# EAGLE design lightmeter_proto2 (EAGLE 7.1.0)
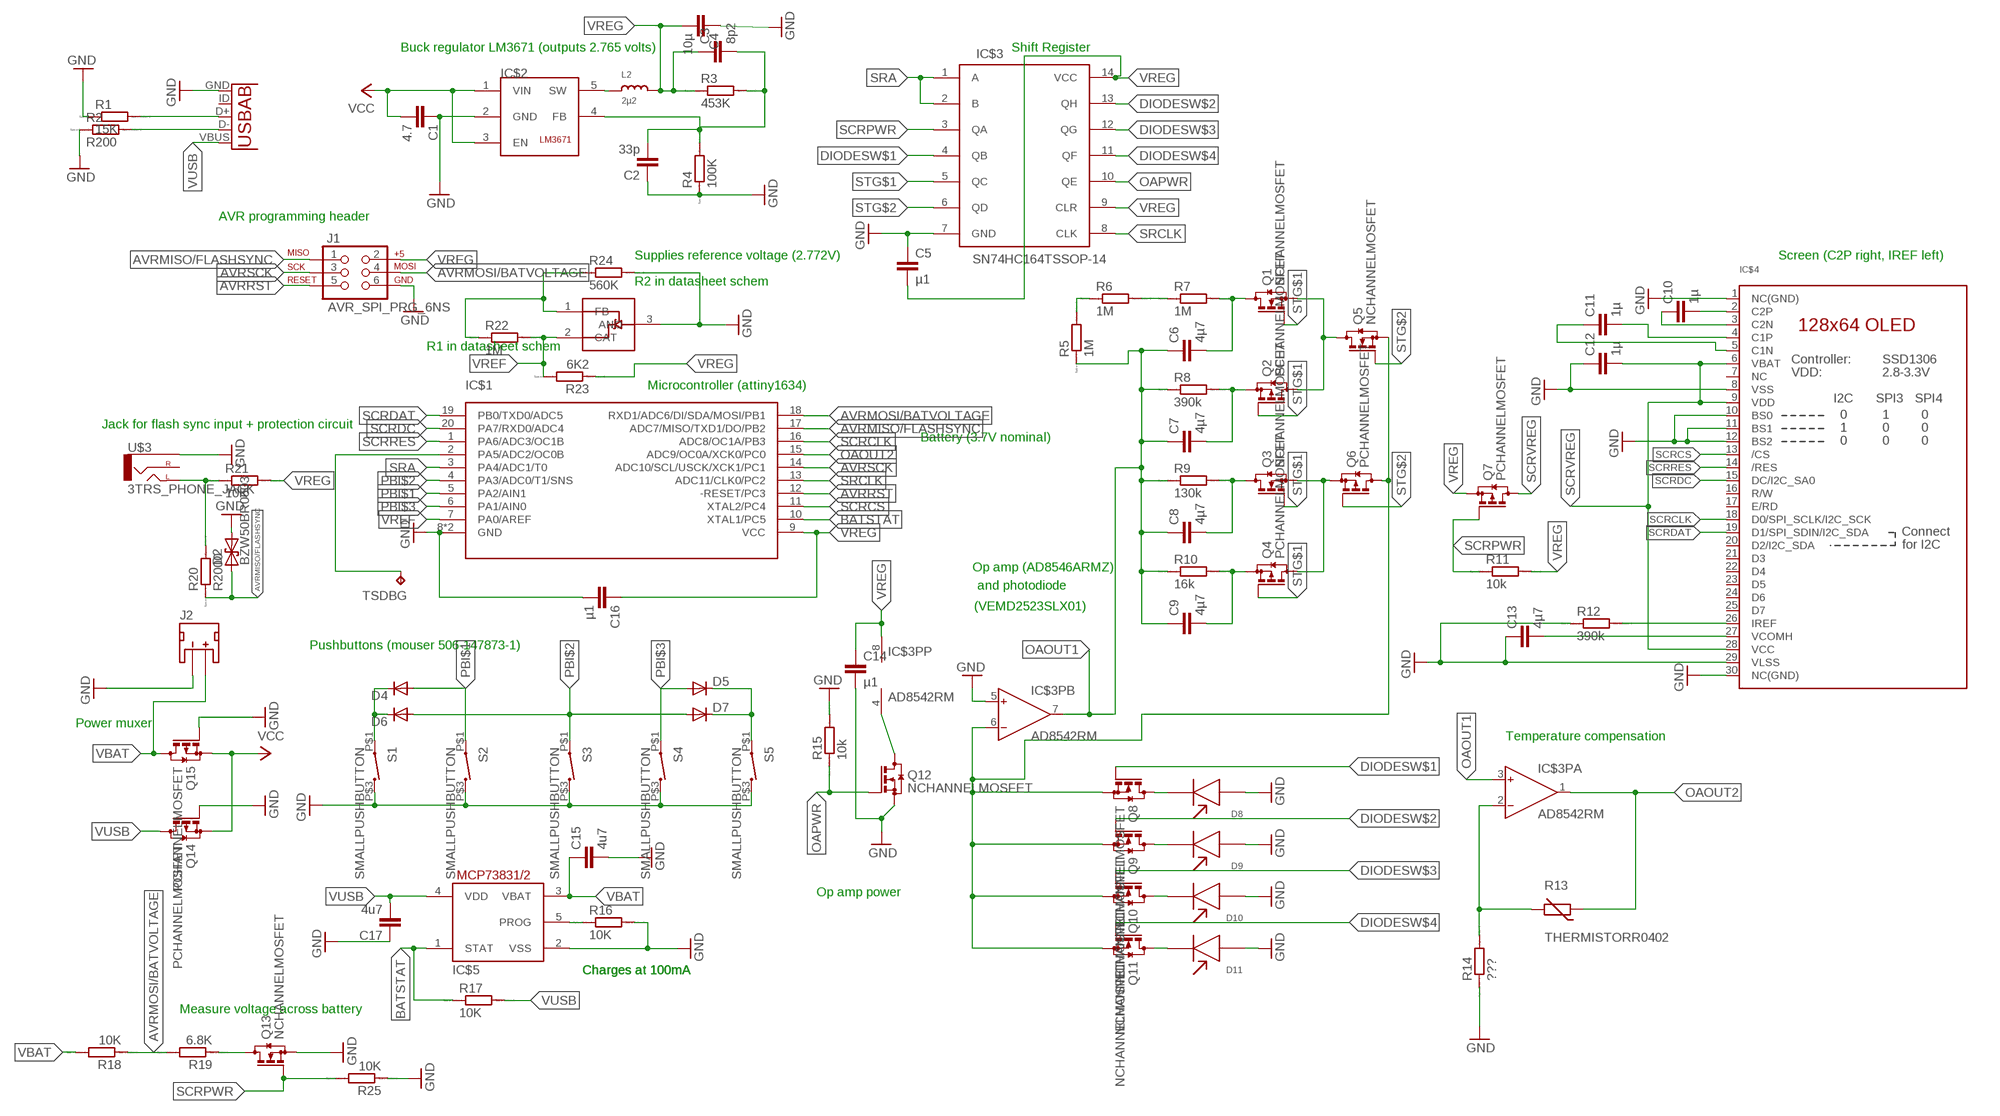
[diagram p0: schematic, sheet 1]

## Parts
C1  4.7  C-EUC0402  [C0402]
C2  33p  C-EUC0402  [C0402]
C3  8p2  C-EUC0402  [C0402]
C4  10µ  C-EUC0402  [C0402]
C5  µ1  C-EUC0402  [C0402]
C6  4µ7  C-EUC0402  [C0402]
C7  4µ7  C-EUC0402  [C0402]
C8  4µ7  C-EUC0402  [C0402]
C9  4µ7  C-EUC0402  [C0402]
C10  1µ  C-EUC0402  [C0402]
C11  1µ  C-EUC0402  [C0402]
C12  1µ  C-EUC0402  [C0402]
C13  4µ7  C-EUC0402  [C0402]
C14  µ1  C-EUC0402  [C0402]
C15  4u7  C-EUC0402  [C0402]
C16  µ1  C-EUC0402  [C0402]
C17  4u7  C-EUC0402  [C0402]
D2  BZW50BR0603  [R0603]
D4  DIODE-SOD323-W  [SOD323-W]
D5  DIODE-SOD323-W  [SOD323-W]
D6  DIODE-SOD323-W  [SOD323-W]
D7  DIODE-SOD323-W  [SOD323-W]
D8  VEMD2523SLX01  [VEMD2523SLX01]
D9  VEMD2523SLX01  [VEMD2523SLX01]
D10  VEMD2523SLX01  [VEMD2523SLX01]
D11  VEMD2523SLX01  [VEMD2523SLX01]
IC$1  ATTINY1634MLF20  [MLF20]
IC$2  LM3671  [SOT23-5]
IC$3  SN74HC164TSSOP-14  [TSSOP14]
IC$3P  AD8542RM  [MSOP08]
IC$4  DISP_OLED_UG-2864HSWEG010.96"  [UG-2864HSWEG01_0.96IN_WRAPAROUND]
IC$5  MCP73831/OT  [SOT23-5L]
IC$6  TL4051  [SOT23]
J1  AVR_SPI_PRG_6NS  [2X3-NS]
J2  JST_2MM_MALE  [JST-2-SMD]
L2  2µ2  INDUCTOR_0402  [_0402]
Q1  NCHANNELMOSFET  [SOT-416-3]
Q2  PCHANNELMOSFET  [SOT-416-3]
Q3  NCHANNELMOSFET  [SOT-416-3]
Q4  PCHANNELMOSFET  [SOT-416-3]
Q5  NCHANNELMOSFET  [SOT-416-3]
Q6  PCHANNELMOSFET  [SOT-416-3]
Q7  PCHANNELMOSFET  [SOT-416-3]
Q8  NCHANNELMOSFET  [SOT-416-3]
Q9  NCHANNELMOSFET  [SOT-416-3]
Q10  NCHANNELMOSFET  [SOT-416-3]
Q11  NCHANNELMOSFET  [SOT-416-3]
Q12  NCHANNELMOSFET  [SOT-416-3]
Q13  NCHANNELMOSFET  [SOT-416-3]
Q14  PCHANNELMOSFET  [SOT-416-3]
Q15  PCHANNELMOSFET  [SOT-416-3]
R1  15K  R-EU_R0402  [R0402]
R2  R200  R-EU_R0402  [R0402]
R3  453K  R-EU_R0402  [R0402]
R4  100K  R-EU_R0402  [R0402]
R5  1M  R-EU_R0402  [R0402]
R6  1M  R-EU_R0402  [R0402]
R7  1M  R-EU_R0402  [R0402]
R8  390k  R-EU_R0402  [R0402]
R9  130k  R-EU_R0402  [R0402]
R10  16k  R-EU_R0402  [R0402]
R11  10k  R-EU_R0402  [R0402]
R12  390k  R-EU_R0402  [R0402]
R13  THERMISTORR0402  [R0402]
R14  ???  R-EU_R0402  [R0402]
R15  10k  R-EU_R0402  [R0402]
R16  10K  R-EU_R0402  [R0402]
R17  10K  R-EU_R0402  [R0402]
R18  10K  R-EU_R0402  [R0402]
R19  6.8K  R-EU_R0402  [R0402]
R20  R2000  R-EU_R0402  [R0402]
R21  10K  R-EU_R0402  [R0402]
R22  1M  R-EU_R0402  [R0402]
R23  6K2  R-EU_R0402  [R0402]
R24  560K  R-EU_R0402  [R0402]
R25  10K  R-EU_R0402  [R0402]
S1  SMALLPUSHBUTTON  [BUTTON]
S2  SMALLPUSHBUTTON  [BUTTON]
S3  SMALLPUSHBUTTON  [BUTTON]
S4  SMALLPUSHBUTTON  [BUTTON]
S5  SMALLPUSHBUTTON  [BUTTON]
TSDBG  TPPAD1-13  [P1-13]
U2  USB-AB"  [USB_AB_MICRO_1:1_V2]
U$3  3TRS_PHONE_JACK  [3TRS-SMD]

## Nets
AVRMISO/FLASHSYNC: D2.1 IC$1.17(ADC7/MISO/TXD1/DO/PB2) J1.1 R20.1
AVRMOSI/BATVOLTAGE: IC$1.18(RXD1/ADC6/DI/SDA/MOSI/PB1) J1.4 R18.1 R19.2
AVRRST: IC$1.12(-RESET/PC3) J1.5
AVRSCK: IC$1.14(ADC10/SCL/USCK/XCK1/PC1) J1.3
BATSTAT: IC$1.10(XTAL1/PC5) IC$5.1(STAT) R17.1
DIODESW$1: IC$3.4(QB) Q8.P$1(G)
DIODESW$2: IC$3.13(QH) Q9.P$1(G)
DIODESW$3: IC$3.12(QG) Q10.P$1(G)
DIODESW$4: IC$3.11(QF) Q11.P$1(G)
GND: C1.1 C2.1 C4.1 C5.1 C12.1 C13.1 C14.2 C15.2 C16.2 C17.1 D2.2 D8.P$1 D9.P$1 D10.P$1 D11.P$1 IC$1.8(GND) IC$1.GND IC$2.2(GND) IC$3.7(GND) IC$3P.5(B:IN+) IC$4.1(NC(GND)) IC$4.8(VSS) IC$4.10(BS0) IC$4.11(BS1) IC$4.12(BS2) IC$4.29(VLSS) IC$4.30(NC(GND)) IC$5.2(VSS) IC$6.3(ANO) J1.6 J2.1(-) Q12.P$2(S) Q13.P$2(S) Q14.P$1(G) Q15.P$1(G) R1.1 R2.1 R4.1 R12.1 R14.1 R15.2 R16.2 R24.2 R25.1 S1.P$3 S2.P$3 S3.P$3 S4.P$3 S5.P$3 U2.GND U$3.P$1(SLEEVE)
N$1: D8.P$2 Q8.P$3(D)
N$2: D9.P$2 Q9.P$3(D)
N$3: C7.2 Q2.P$2(S) R8.2
N$4: C9.2 Q4.P$2(S) R10.2
N$5: IC$5.5(PROG) R16.1
N$6: IC$3P.4(P:V-) Q12.P$3(D)
N$7: D5.C D7.C S5.P$1
N$8: D4.C D6.C S1.P$1
N$9: D10.P$2 Q10.P$3(D)
N$10: IC$2.5(SW) L2.1
N$11: D11.P$2 Q11.P$3(D)
N$12: C13.2 IC$4.27(VCOMH)
N$13: R6.2 R7.1
N$14: C8.2 Q3.P$3(D) R9.2
N$15: C10.2 IC$4.2(C2P)
N$16: C10.1 IC$4.3(C2N)
N$17: Q13.P$3(D) R19.1
N$18: R5.2 R6.1
N$19: IC$4.26(IREF) R12.2
N$20: Q1.P$2(S) Q2.P$3(D) Q5.P$3(D)
N$21: C6.2 Q1.P$3(D) R7.2
N$22: Q3.P$2(S) Q4.P$3(D) Q6.P$2(S)
N$23: IC$1.2(PA5/ADC2/OC0B) TSDBG.TP
N$24: C11.1 IC$4.5(C1N)
N$25: IC$6.1(FB) R22.1 R24.1
N$26: IC$3P.6(B:IN-) Q5.P$2(S) Q6.P$3(D) Q8.P$2(S) Q9.P$2(S) Q10.P$2(S) Q11.P$2(S)
N$27: C11.2 IC$4.4(C1P)
N$28: R1.2 U2.D+
N$29: R20.2 R21.1 U$3.P$3(LEFT)
N$31: IC$3P.2(A:IN-) R13.2 R14.2
N$32: R2.2 U2.D-
N$33: C2.2 C3.2 IC$2.4(FB) R3.2 R4.2
OAOUT1: C6.1 C7.1 C8.1 C9.1 IC$3P.3(A:IN+) IC$3P.7(B:OUT) R5.1 R8.1 R9.1 R10.1
OAOUT2: IC$1.15(ADC9/OC0A/XCK0/PC0) IC$3P.1(A:OUT) R13.1
OAPWR: IC$3.10(QE) Q12.P$1(G) R15.1
PBI$1: D4.A IC$1.5(PA2/AIN1) S2.P$1
PBI$2: D6.A D7.A IC$1.4(PA3/ADC0/T1/SNS) S3.P$1
PBI$3: D5.A IC$1.6(PA1/AIN0) S4.P$1
SCRCLK: IC$1.16(ADC8/OC1A/PB3) IC$4.18(D0/SPI_SCLK/I2C_SCK)
SCRCS: IC$1.11(XTAL2/PC4) IC$4.13(/CS)
SCRDAT: IC$1.19(PB0/TXD0/ADC5) IC$4.19(D1/SPI_SDIN/I2C_SDA)
SCRDC: IC$1.20(PA7/RXD0/ADC4) IC$4.15(DC/I2C_SA0)
SCRPWR: IC$3.3(QA) Q7.P$1(G) Q13.P$1(G) R11.1 R25.2
SCRRES: IC$1.1(PA6/ADC3/OC1B) IC$4.14(/RES)
SCRVREG: C12.2 IC$4.6(VBAT) IC$4.9(VDD) IC$4.28(VCC) Q7.P$3(D)
SRA: IC$1.3(PA4/ADC1/T0) IC$3.1(A) IC$3.2(B)
SRCLK: IC$1.13(ADC11/CLK0/PC2) IC$3.8(CLK)
STG$1: IC$3.5(QC) Q1.P$1(G) Q2.P$1(G) Q3.P$1(G) Q4.P$1(G)
STG$2: IC$3.6(QD) Q5.P$1(G) Q6.P$1(G)
VBAT: C15.1 IC$5.3(VBAT) J2.2(+) Q15.P$3(D) R18.2
VCC: C1.2 IC$2.1(VIN) IC$2.3(EN) Q14.P$2(S) Q15.P$2(S)
VREF: IC$1.7(PA0/AREF) IC$6.2(CAT) R22.2 R23.2
VREG: C3.1 C4.2 C5.2 C14.1 C16.1 IC$1.9(VCC) IC$3.9(CLR) IC$3.14(VCC) IC$3P.8(P:V+) J1.2 L2.2 Q7.P$2(S) R3.1 R11.2 R21.2 R23.1
VUSB: C17.2 IC$5.4(VDD) Q14.P$3(D) R17.2 U2.VBUS
Unconnected: IC$4.7(NC) IC$4.16(R/W) IC$4.17(E/RD) IC$4.20(D2/I2C_SDA) IC$4.21(D3) IC$4.22(D4) IC$4.23(D5) IC$4.24(D6) IC$4.25(D7) J2.NC1(PAD1) J2.NC2(PAD2) U2.ID(USBID) U$3.P$2(RIGHT)

## Notes on the sheet
- Buck regulator LM3671 (outputs 2.765 volts) | Shift Register
- AVR programming header
- Supplies reference voltage (2.772V) | Screen (C2P right, IREF left)
- R2 in datasheet schem
- R1 in datasheet schem
- Microcontroller (attiny1634)
- Jack for flash sync input + protection circuit
- Battery (3.7V nominal)
- Op amp (AD8546ARMZ)
- and photodiode
- (VEMD2523SLX01)
- Pushbuttons (mouser 506-147873-1)
- Power muxer
- Temperature compensation
- Op amp power
- Charges at 100mA | Charges at 100mA
- Measure voltage across battery

## Library data of the parts
C1-C17 = rcl:C-EU: CAPACITOR, European symbol
D2 = lightmeter:BZW50B: DIODE uni and bidirectional supressor diode
D4-D7 = diode2:DIODE-: DIODE
D8-D11 = lightmeter:VEMD2523SLX01
IC$1 = attiny1634_corrected:ATTINY1634
IC$2 = lightmeter:LM3671
IC$3 = lightmeter:SN74HC164
IC$3P = analog-devices:AD8542: General-Purpose CMOS Rail-to-Rail Amplifiers Source: http://www.analog.com/static/imported-files/data_sheets/AD8541_8542_8544.pdf; MPN: AD8542ARZ; OC_FARNELL: 1464965; OC_NEWARK: 19M0965
IC$4 = microbuilder:DISP_OLED_UG-2864HSWEG01: UG-2864HSWEG01 OLED display Both 1.3" and 0.96" models share the same FPC tab footprint, only the screen dimensions vary.
IC$5 = adafruit:MCP73831: MCP73831/2 Miniature Single-Cell, Fully Integrated Li-Ion, Li-Polymer Charge Management Controllers. Nice and small simple lipoly charge controller, with adjustable current and status output (LED) http://www.ladyada.net/library/pcb/eaglelibrary.html
IC$6 = lightmeter:TL4051
J1 = SparkFun-Connectors:AVR_SPI_PRG_6: AVR ISP 6 Pin This is the reduced ISP connector for AVR programming. Common on Arduino. This footprint will take up less PCB space and can be used with a 10-pin to 6-pin adapter such as SKU: BOB-08508 **Special note about "TEST_POINT" package. The stop mask is on the top side, so if you want your programming test points to be on the bottom of your board, make sure to place this package on the bottom side of the board. This also ensure that the orientation to program from the bottom side will be correct.
J2 = SparkFun-Connectors:JST_2MM_MALE: Mates to single-cell LiPo batteries. CONN-08352; PROD_ID: CONN-08352
L2 = microbuilder:INDUCTOR: Inductors 0603: 10nH Ceramic Inductor - microwire antenna/RF (Digikey: 712-1434-2-ND) 0805: 560nH Ceramic Inductor - RF (Digikey: 553-1047-1-ND) 270nH Ceramic Inductor - Q = 40@250MHz, +-5%, 1 Ohm DC Resistance (Digikey: 535-10506-2-ND) 1007 (2518 Metric) SMT: 10µH 10% 250mOhm 820mA 1007 Inductor (Digikey: 587-2189-1-ND) 22µH 10% 500mOhm 580mA 1007 Inductor (Digikey: 587-2190-1-ND) 47µH 10% 950mOhm 420mA 1007 Inductor (Digikey: 587-2191-1-ND) 47µH 5% 100mOhm 1A 1008 Inductor (Digikey: 732-1816-1-ND) 5.0x5.0mm (Taiyo Yuden NR5040 Series) 6.8µH 20% 2.3A 64mOhm Inductor (Digikey: 587-2374-2-ND) 5.0x5.0mm (TDK VLC5045 Series) 4.7µH 20% 3.3A 34mOhm Inductor (Digikey: 445-6526-1-ND) 6.8µH 20% 2.7A 46mOhm Inductor (Digikey: 445-6527-1-ND) 6.0x6.0mm (TDK VLC6045 Series) 4.7µH 20% 3.8A 27mOhm Inductor (Digikey: 445-6538-2-ND) 6.8µH 20% 3A 41mOhm Inductor (Digikey: 445-6540-1-ND) 6.2µH 30% 2.2A 45mOhm Inductor (Digikey: SRR5028-6R2YCT-ND) - Not TDK VLC6045 but footprint should match 6.0x6.0mm (TDK SLF6045 Series) 6.8uH 30% 2A 33mOhm Inductor (Digikey: 445-4572-1-ND, Mouser: 810-SLF645T6R8N2R0PF)
Q1 Q3 Q5 Q8-Q13 = lightmeter:NCHANNELMOSFET
Q2 Q4 Q6 Q7 Q14 Q15 = lightmeter:PCHANNELMOSFET
R1-R12 R14-R25 = resistor:R-EU_: RESISTOR, European symbol; SPICEPREFIX: R
R13 = lightmeter:THERMISTOR: THERMISTOR
S1-S5 = lightmeter:SMALLPUSHBUTTON
TSDBG = testpad:TP: Test pad
U2 = SparkFun-Connectors:USB-AB: This is a USB AB connector that is compatible with USB OTG. i.e. this connector can serve as a host or device
U$3 = lightmeter:3TRS_PHONE_JACK

## Board
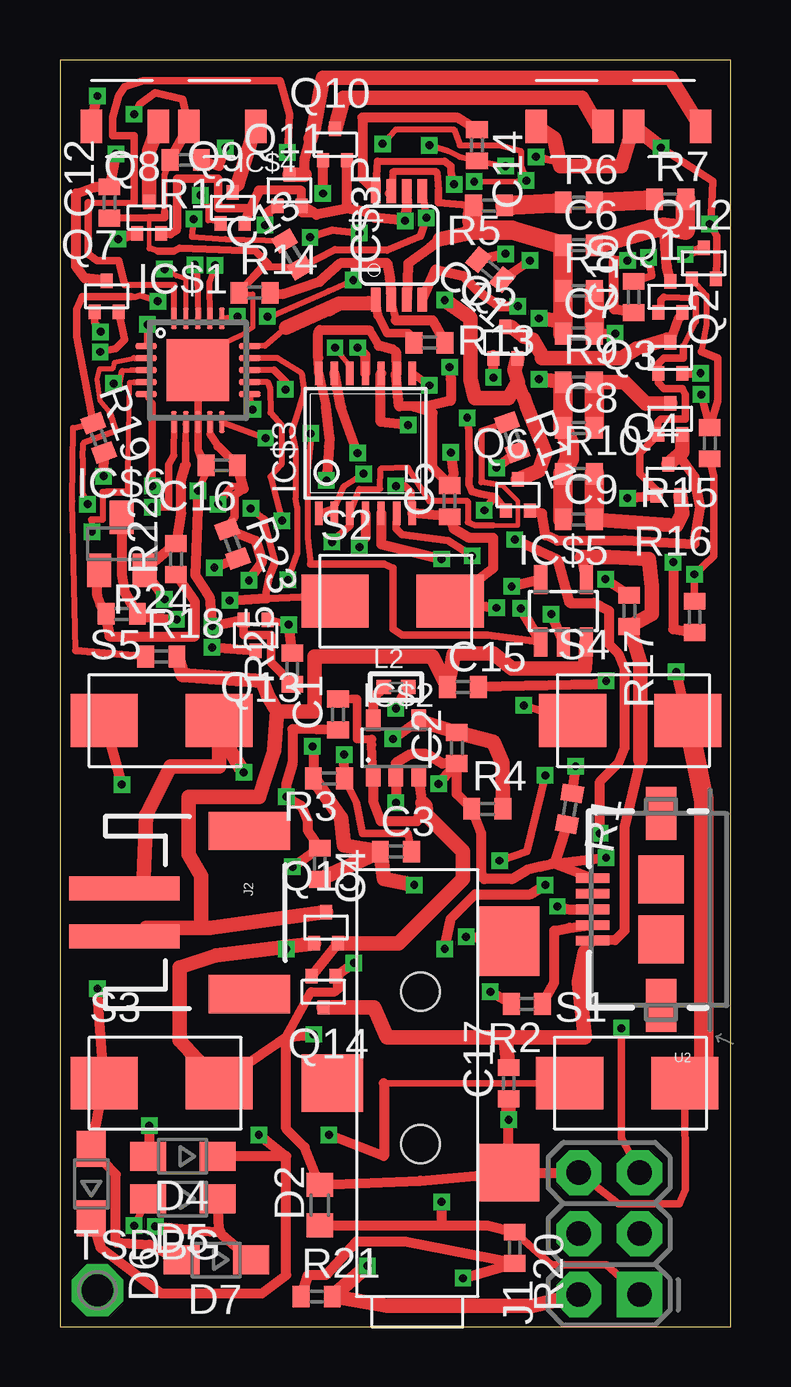
[diagram p1: board, top side]
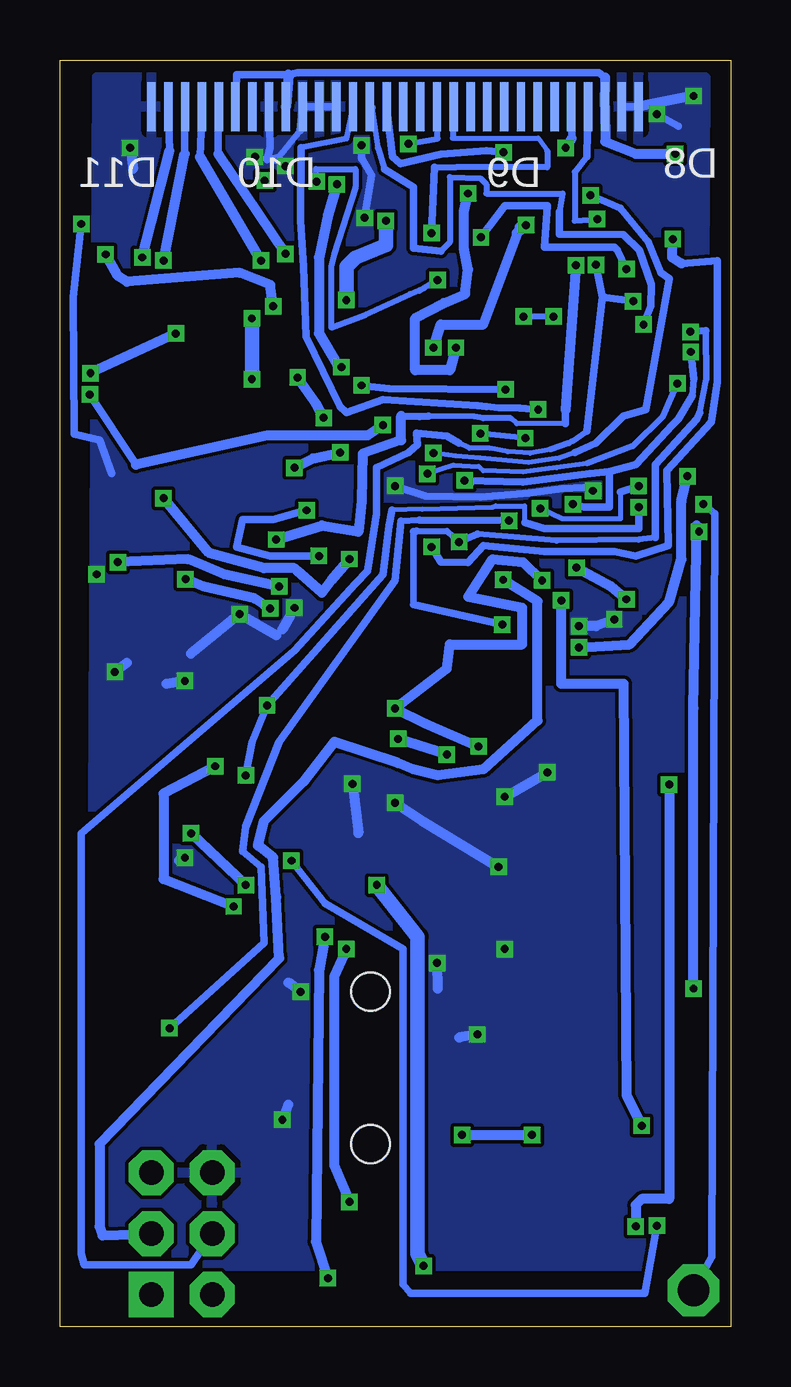
[diagram p2: board, bottom side, seen from below]

Size 27.98 x 52.81 mm. Coordinates in mm from the lower left corner, seen from the top.
Outline: 0,0 27.98,0 27.98,52.81 0,52.81 0,0
Copper layers (1*16): Top 0.0356mm / dielectric 1.5011mm / Bottom 0.0356mm
Design rules "LaenPCBOrder": minimum track width 6mil, minimum drill 13mil, track to track 6mil, track to pad 6mil, pad to pad 6mil, via to via 6mil, smd to smd 6mil, copper to edge 15mil, drill to drill 6mil, minimum pad ring 7mil, minimum via ring 7mil, stop-mask expansion 3mil, vias tented up to drill 0mil, thermal gap 10mil

### Footprints (pad centres in the part's own frame; a part is rotated, then mirrored left to right if it is on the bottom)
C0402 = smd 0.7 x 0.9: 1 -0.65,0; 2 0.65,0
R0603 = smd 1 x 1.1: 1 -0.85,0; 2 0.85,0
SOD323-W = smd 1.5 x 1.2: A 1.45,0; C -1.45,0
VEMD2523SLX01 = smd 0.889 x 1.397: P$1 -3.81,3.81; P$2 -1.016,3.81
MLF20 = smd 0.9 x 0.23: 1 -2.159,1.001; 2 -2.159,0.5; 3 -2.159,0; 4 -2.159,-0.5; 5 -2.159,-1.001; 11 2.159,-1.001; 12 2.159,-0.5; 13 2.159,0; 14 2.159,0.5; 15 2.159,1.001 | smd 0.23 x 0.9: 6 -1.001,-2.159; 7 -0.5,-2.159; 8 0,-2.159; 9 0.5,-2.159; 10 1.001,-2.159; 16 1.001,2.159; 17 0.5,2.159; 18 0,2.159; 19 -0.5,2.159; 20 -1.001,2.159 | smd 2.6 x 2.6: GND 0,0
SOT23-5 = smd 0.6 x 0.9: 1 -0.95,-1.15; 2 0,-1.15; 3 0.95,-1.15; 4 0.95,1.15; 5 -0.95,1.15
TSSOP14 = smd 0.305 x 0.991: 1 -1.95,-2.918; 2 -1.3,-2.918; 3 -0.65,-2.918; 4 0,-2.918; 5 0.65,-2.918; 6 1.3,-2.918; 7 1.95,-2.918; 8 1.95,2.918; 9 1.3,2.918; 10 0.65,2.918; 11 0,2.918; 12 -0.65,2.918; 13 -1.3,2.918; 14 -1.95,2.918
MSOP08 = smd 0.4 x 1: 1 -0.976,-2.263; 2 -0.326,-2.263; 3 0.324,-2.263; 4 0.974,-2.263; 5 0.974,2.262; 6 0.324,2.262; 7 -0.326,2.262; 8 -0.976,2.262
UG-2864HSWEG01_0.96IN_WRAPAROUND = smd 0.35 x 2.057 bottom: 1 -10.15,-1.2; 2 -9.45,-1.2; 3 -8.75,-1.2; 4 -8.05,-1.2; 5 -7.35,-1.2; 6 -6.65,-1.2; 7 -5.95,-1.2; 8 -5.25,-1.2; 9 -4.55,-1.2; 10 -3.85,-1.2; 11 -3.15,-1.2; 12 -2.45,-1.2; 13 -1.75,-1.2; 14 -1.05,-1.2; 15 -0.35,-1.2; 16 0.35,-1.2; 17 1.05,-1.2; 18 1.75,-1.2; 19 2.45,-1.2; 20 3.15,-1.2; 21 3.85,-1.2; 22 4.55,-1.2; 23 5.25,-1.2; 24 5.95,-1.2; 25 6.65,-1.2; 26 7.35,-1.2; 27 8.05,-1.2; 28 8.75,-1.2; 29 9.45,-1.2; 30 10.15,-1.2
SOT23-5L = smd 0.55 x 1.2: 1 -0.95,-1.3; 2 0,-1.3; 3 0.95,-1.3; 4 0.95,1.3; 5 -0.95,1.3
SOT23 = smd 1 x 1.4: 1 -0.95,-1.1; 2 0.95,-1.1; 3 0,1.1
2X3-NS = drill 1.016 pad 1.88 square: 1 -2.54,-1.27 | drill 1.016 pad 1.88 octagon: 2 -2.54,1.27; 3 0,-1.27; 4 0,1.27; 5 2.54,-1.27; 6 2.54,1.27
JST-2-SMD = smd 1 x 4.6: 1 -1,-3.7; 2 1,-3.7 | smd 1.6 x 3.4: NC1 -3.4,1.5; NC2 3.4,1.5
_0402 = smd 0.6 x 0.6: 1 -0.508,0; 2 0.508,0
SOT-416-3 = smd 0.5 x 0.6: P$1 -0.5,-0.9; P$2 0.5,-0.9; P$3 0,0.4
R0402 = smd 0.7 x 0.9: 1 -0.65,0; 2 0.65,0
BUTTON = smd 2.8 x 2.2: P$1 -2.54,0; P$3 2.26,0
P1-13 = drill 1.321 pad 2.159 octagon: TP 0,0
USB_AB_MICRO_1:1_V2 = smd 1.4 x 0.4: D+ 2.85,0; D- 2.85,0.65; GND 2.85,-1.3; ID 2.85,-0.65; VBUS 2.85,1.3 | smd 1.9 x 2: P$6 0,1.25; P$7 0,-1.25 | smd 1.27 x 2.2: P$8 0,4; P$9 0,-4
3TRS-SMD = smd 2.388 x 2.553: P$1 -6.274,-1.27; P$2 -2.54,6.083 | smd 2.896 x 2.553: P$3 3.378,-1.27 | hole 1.6: -5.08,2.407; 1.27,2.407

### Placement (x,y rotation side)
C1  11.6,25.53 90 top
C2  16.55,24.13 90 top
C3  14.01,19.81 0 top
C4  10.83,19.3 270 top
C5  16.24,34.42 90 top
C6  21.63,45.09 0 top
C7  21.63,41.4 0 top
C8  21.63,37.47 0 top
C9  21.63,33.66 0 top
C10  23.91,42.93 90 top
C11  17.95,44.07 320 top
C12  2.07,46.86 90 top
C13  9.69,44.7 120 top
C14  17.38,49.25 270 top
C15  16.8,26.67 0 top
C16  6.74,35.92 180 top
C17  18.71,10.16 90 top
D2  10.83,5.08 90 top
D4  5.12,7.11 180 top
D5  5.12,5.33 180 top
D6  1.31,5.97 90 top
D7  6.52,2.79 180 top
D8  5.12,46.23 0 top
D9  9.18,46.23 0 top
D10  23.66,46.23 0 top
D11  27.72,46.23 0 top
IC$1  5.75,39.88 0 top
IC$2  14.01,24.13 0 top
IC$3  12.74,36.83 0 top
IC$3P  14.14,45.09 0 top
IC$4  14.01,49.66 180 top
IC$5  20.99,29.84 0 top
IC$6  2.58,32.64 0 top
J1  22.9,3.89 90 top
J2  6.39,17.27 270 top
L2  14.01,26.67 0 top
Q1  25.44,43.18 0 top
Q2  25.44,40.64 0 top
Q3  25.44,38.1 0 top
Q4  25.36,35.56 0 top
Q5  18.58,41.27 0 top
Q6  19.09,34.92 0 top
Q7  1.94,43.21 0 top
Q8  3.72,46.48 0 top
Q9  7.2,46.89 0 top
Q10  11.47,49.53 0 top
Q11  9.56,47.62 0 top
Q12  26.84,44.58 0 top
Q13  8.17,28.57 180 top
Q14  10.99,13.72 180 top
Q15  11.09,16.89 0 top
R1  21.25,21.59 80 top
R2  19.47,13.46 0 top
R3  11.21,22.86 0 top
R4  17.82,21.59 0 top
R5  17.89,46.74 0 top
R6  21.63,46.86 0 top
R7  25.44,46.99 0 top
R8  21.63,43.18 0 top
R9  21.63,39.37 0 top
R10  21.63,35.56 0 top
R11  18.86,37.08 290 top
R12  5.25,48.64 0 top
R13  15.41,41.02 0 top
R14  8.12,43.1 0 top
R15  27.09,36.83 270 top
R16  26.45,29.59 90 top
R17  23.74,29.84 270 top
R18  4.23,27.94 0 top
R19  1.61,37.06 110 top
R20  18.96,3.3 270 top
R21  10.71,1.27 0 top
R22  4.84,32 90 top
R23  7.2,32.64 290 top
R24  2.58,29.72 0 top
R25  9.69,27.43 90 top
S1  23.79,10.16 0 top
S2  14.01,30.25 0 top
S3  4.38,10.16 0 top
S4  23.91,25.27 0 top
S5  4.38,25.27 0 top
TSDBG  1.56,1.52 0 top
U2  25.06,17.4 180 top
U$3  17.44,12.7 90 top

### Tracks (layer width: path | path; a pad name or v marks a point on that pad's centre or on a via)
AVRMISO/FLASHSYNC  (via drill 0.33)
  Top 0.229: 6.24,43.55 v6.46,44.25
  Top 0.254: IC$1.17 6.24,43.55
  Top 0.305: R20.1 20.49,2.59 22.77,2.59 J1.1
  Top 0.406: D2.1 15.91,4.23 | 15.91,4.23 17.82,4.23 R20.1 | v18.96,32.82 20.74,32 21.25,30.18 22.26,30.18 22.9,29.84 22.9,28.45 23.28,28.07 23.53,27.43 23.53,24.13 23.28,23.5 22.52,22.73 v22.52,20.57 | v15.91,5.21 15.91,4.23 | v20.23,18.41 19.6,18.03 17.31,18.03 16.29,17.02 v16.04,15.75
  Bottom 0.203: 6.9,37.64 8.93,37.64 9.18,37.87
  Bottom 0.254: 12.61,37.97 10.71,37.95 10.33,37.87 9.18,37.87
  Bottom 0.305: 6.9,38.23 6.9,37.64 | 13.75,37.97 12.99,37.95 12.61,37.97
  Bottom 0.406: v6.46,44.25 6.9,38.23 | v22.52,20.57 v20.23,18.41 | v18.96,32.82 17.06,33.4 15.53,33.15 15.41,34.42 15.35,36.4 13.75,36.96 13.75,37.97 | v16.04,15.75 16.55,14.61 16.55,6.73 v15.91,5.21
AVRMOSI/BATVOLTAGE  (via drill 0.33)
  Top 0.254: 2.96,42.95 3.09,42.93 3.34,43 v4.08,42.75 | R19.2 0.55,37.47 0.52,34.42 0.65,28.19 | v5.63,44.27 5.73,43.81 IC$1.18
  Top 0.305: R19.2 0.7,41.27 0.7,42.42 0.93,42.95 2.96,42.95 | R18.1 0.65,28.19
  Bottom 0.203: 11.34,36.83 10.91,36.63 10.07,36.63 9.31,36.47 8.37,36.41 7.53,36.58
  Bottom 0.254: 6.01,37.34 6.64,36.91 6.77,36.83 7.53,36.58
  Bottom 0.305: J1.4 22.52,2.59 26.96,2.59 27.09,3.05 27.09,20.57 18.2,28.19 15.66,30.99 15.15,31.5 14.77,33.91 14.77,35.81 13.45,36.45 13.07,36.78 13.12,37.26 11.85,37.13 11.34,36.83 | 6.01,37.34 5.37,42.93 | 5.37,42.93 v5.63,44.27 | v4.08,42.75 5.37,42.93
AVRRST  (via drill 0.33)
  Top 0.254: v9.26,33.6 8.78,35.43 9.23,35.94 9.23,37.59 8.78,38.1 8.75,39.12 8.67,39.38 IC$1.12
  Top 0.305: v23.41,12.45 23.41,7.87 J1.5
  Bottom 0.279: 12.99,33.63 13.75,33.58
  Bottom 0.305: v9.26,33.6 12.99,33.63 | 13.75,33.58 14.01,31.11 18.83,24.38 20.23,20.83 20.36,19.81 19.6,19.18 19.47,16 v23.41,12.45
AVRSCK  (via drill 0.33)
  Top 0.254: v9.5,31.14 9.89,32.26 9.89,34.16 9.82,34.54 9.82,36.58 9.67,37.34 9.87,37.97 10.17,38.99 10.07,39.75 9.06,40.39 IC$1.14
  Bottom 0.406: J1.3 26.2,3.81 26.33,4.19 26.33,7.62 18.83,15.37 18.96,17.91 19.09,19.56 19.72,20.07 19.47,21.08 17.82,22.73 16.55,24.38 13.88,23.5 13.25,23.24 12.23,22.99 10.33,23.24 8.06,25.27 8.06,30.25 v9.5,31.14
BATSTAT  (via drill 0.33)
  Top 0.254: IC$1.10 v8.57,37.05 | v10.45,37.24 10.45,36.83 10.33,35.69 10.33,32.89 10.45,31.8
  Top 0.305: 10.45,31.8 13.5,31.8 13.88,31.62 13.88,29.08 14.26,28.83 17.82,28.83 IC$5.1
  Top 0.406: IC$5.1 v19.22,29.95 | v22.75,31.17 R17.1
  Bottom 0.254: v8.57,37.05 v10.45,37.24
  Bottom 0.406: v22.75,31.17 22.01,30.86 19.85,30.35 19.47,30.1 v19.22,29.95
DIODESW$1  (via drill 0.33)
  Top 0.305: 12.74,32.89 v12.48,32.51
  Top 0.406: Q8.P$1 v2.43,45.34 | IC$3.4 12.74,32.89
  Bottom 0.305: v12.48,32.51 12.1,31.88 10.96,31.85 10.33,32.58 7.79,32.32 4.86,32.31 3.98,32.13 2.6,32.56 2.68,35.69 0.83,37.72 0.57,39.37 0.57,44.45 2.07,44.32
  Bottom 0.406: 2.07,44.32 2.45,44.58 v2.43,45.34
DIODESW$2  (via drill 0.33)
  Top 0.203: Q9.P$1 6.39,46.1 6.17,46.1 6.17,46.74 v5.86,47.17
  Top 0.406: v12.41,36.42 11.72,38.32 IC$3.13
  Bottom 0.203: 6.52,36.45 7.18,36.21 8.45,36.03 10.45,36.22 11.47,36.3 v12.41,36.42
  Bottom 0.305: v5.86,47.17 4.61,46.63 3.44,45.21 2.93,43.94 2.58,43.69 3.54,38.23 4.48,37.97 5.63,36.83 6.52,36.45
DIODESW$3  (via drill 0.33)
  Top 0.203: 12,40.15 v11.47,40.82
  Top 0.254: 12,40.15 IC$3.12
  Top 0.406: v10.96,47.24 Q10.P$1
  Bottom 0.406: v11.47,40.82 11.72,39.88 13.17,39.88 13.17,42.04 11.98,42.67 11.09,43.05 10.96,44.07 11.14,44.96 11.14,46.48 v10.96,47.24
DIODESW$4  (via drill 0.33)
  Top 0.406: Q11.P$1 8.69,46.47 v8.55,45.92 | IC$3.11 12.74,40.51 v12.41,40.82
  Bottom 0.406: v8.55,45.92 8.93,45.59 8.8,45.85 10.33,41.78 12.1,41.78 v12.41,40.82
GND  (via drill 0.33)
  Top 0.191: 3.72,44.96 3.72,46.22
  Top 0.203: R14.1 8.04,43.05 8.04,41.66 7.53,41.33 6.39,40.77 IC$1.GND
  Top 0.254: R14.1 8.67,44.32 | 4.1,44.83 3.72,44.96 | v18.58,48.39 C14.2 16.68,48.77 16.17,49.02 v15.41,49.25 | 4.36,46.48 4.36,48.01 R12.1
  Top 0.305: 4.36,46.48 4.36,46.23 3.72,46.22 C12.1 | J1.6 23.28,5.13 25.82,5.13 26.07,5.71 S1.P$3 | C16.2 5.75,36.58 | 5.75,36.58 IC$1.8 IC$1.GND | R14.1 8.43,44.2 C13.1 11.47,44.91 13.63,44.88 15.02,45.47 v15.28,46.23 IC$3P.5 | D9.P$1 5.12,51.18 3.98,51.44 3.32,50.96 v3.09,50.55 | v25.06,49.15 27.22,47.75 27.17,46.35 v27.09,45.97 27.39,45.47 27.39,44.32 Q12.P$2 | 5.75,36.58 5.88,36.2 6.13,35.69 v5.75,34.85 | v14.01,35.05 14.39,35.05 14.64,34.8 IC$3.7 | v19.85,48.77 20.72,48.57 | 4.1,44.83 4.74,44.83 4.99,44.96 6.64,44.91 8.17,44.83 8.67,44.32 | R15.2 27.27,35.43 27.27,32.13 v26.45,31.37 R16.2
  Top 0.356: R25.1 8.8,27.69 8.8,28.83 7.66,28.83 Q13.P$2
  Top 0.381: 9.44,12.06 10.48,13.97 11.47,13.97 11.6,14.1
  Top 0.406: C2.1 15.93,23.48 15.28,23.88 14.64,23.88 14.01,23.5 IC$2.2 v14.01,21.84 | C2.1 16.55,22.21 R4.1 17.56,20.57 17.56,18.92 17.69,18.67 18.83,18.67 19.47,19.05 19.98,19.18 | 2.66,33.78 IC$6.3 2.58,31.37 2.71,30.61 R24.2 3.23,29.61 v4.86,29.49 | IC$3.7 C5.1 16.42,33.27 17.06,32.89 18.07,32.89 18.07,31.62 S2.P$3 v18.2,29.97 | 9.44,12.06 9.44,8.26 10.2,7.49 D2.2 15.02,6.1 U$3.P$1 | 11.6,14.1 11.6,14.61 Q14.P$1 v12.26,15.16 | U$3.P$1 J1.6 | C15.2 22.26,26.78 v22.77,26.92 | U2.GND 20.61,19.3 | 20.61,19.3 19.98,19.18 | 9.44,12.06 S3.P$3 | D8.P$1 v1.56,51.31 | D9.P$1 R12.1 | J2.1 3.47,18.16 | U$3.P$1 v18.71,8.64 | R2.1 v17.95,13.97 | R1.1 20.61,19.3 | 19.98,19.18 20.49,19.3 v22.77,19.56 | Q15.P$1 v9.44,15.75 | 9.44,12.06 v10.58,12.19 | C1.1 9.69,24.92 9.69,23.5 9.44,22.61 v9.44,22.1 10.07,21.72 10.33,21.08 10.33,20.7 C4.1 v9.69,19.18 | IC$5.2 v20.49,29.7 | C2.1 v15.79,22.63 | S4.P$3 v25.69,27.3 | Q13.P$2 v6.34,29.21 6.24,30.43 5.65,31.32 5.75,34.04 v5.75,34.85
  Top 0.61: S5.P$3 6.64,24.77 | 6.64,24.77 6.64,23.37 4.61,23.37 3.59,21.34 3.47,18.16 | v25.06,49.15 D11.P$1 23.41,48.39 20.87,48.39 20.61,49.53 D10.P$1 | v7.66,23.11 6.64,24.77 | Q15.P$1 6.52,15.49 4.99,14.99 4.99,11.94 S3.P$3 | C17.1 v18.71,8.64
  Top 0.813: S4.P$3 26.84,21.97 26.84,10.54 S1.P$3
  Bottom 0.254: 17.96,49.86 18.83,48.77 19.34,48.64 v19.85,48.77 | v18.58,48.39 19.31,48.76
  Bottom 0.305: IC$4.30 IC$4.29 | v3.09,50.55 2.2,50.04 | v14.01,35.05 12.74,34.62 10.45,34.59 8.42,34.75 7.02,34.95 6.13,34.98 v5.75,34.85 | 17.96,49.86 IC$4.10 IC$4.11 IC$4.12 | IC$4.8 19.22,49.15 19.31,48.76 19.34,48.64 | v15.28,46.23 15,48.01 15.38,48.69 15.41,48.69 v15.41,49.25 | 25.82,35.56 26.33,36.96 27.39,37.21 27.42,42.93 v27.09,45.97
  Bottom 0.406: v1.56,51.31 IC$4.30 | v4.86,29.49 5.63,29.21 v6.34,29.21 | v18.71,8.64 18.45,9.27 | v17.95,13.97 18.45,14.35 | v22.77,19.56 23.03,19.43 | v14.01,21.84 12.87,21.08 v9.69,19.18 | v12.26,15.16 12.23,14.1 | v9.44,15.75 9.56,15.88 | v10.58,12.19 11.34,12.06 | v9.44,22.1 v7.66,23.11 | 22.52,28.07 v20.49,29.7 18.96,28.83 | v18.2,29.97 18.71,29.08 | v22.77,26.92 23.53,26.8 | v15.79,22.63 15.53,20.57 | v25.69,27.3 25.18,27.69 | v25.06,49.15 24.93,48.26
  pour Bottom: 1.05,52.07 26.45,52.07 26.71,2.54 1.31,2.54
N$1
  Top 0.61: D8.P$2 3.72,49.02 Q8.P$3
N$2
  Top 0.508: Q9.P$3 7.4,47.62
  Top 0.61: 7.4,47.62 D9.P$2
N$3  (via drill 0.33)
  Top 0.406: C7.2 v23.15,41.4 | v26.71,39.75 Q2.P$2
  Top 0.813: C7.2 R8.2
  Bottom 0.406: v23.15,41.4 v26.71,39.75
N$4
  Top 0.61: Q4.P$2 25.94,33.9 25.69,33.4 C9.2
  Top 0.813: R10.2 C9.2
N$5  (via drill 0.33)
  Top 0.406: IC$5.5 v18.83,30.86 | v25.57,31.88 25.57,29.08 R16.1
  Bottom 0.406: v18.83,30.86 21.12,31.37 22.64,32 v25.57,31.88
N$6  (via drill 0.33)
  Top 0.406: IC$3P.4 15.66,44.07 16.8,43.81 17.44,43.18 18.33,42.55 v19.09,42.55 | v26.07,44.7 Q12.P$3
  Bottom 0.406: v19.09,42.55 19.22,43.43 20.49,43.94 25.18,43.56 25.57,43.81 v26.07,44.7
N$7  (via drill 0.33)
  Top 0.406: D7.C 6.77,3.81 6.72,3.91 | 6.72,3.91 6.64,4.06 D5.C | S5.P$1 v2.58,22.61 | v3.98,4.19 6.69,3.94 6.72,3.91
  Bottom 0.406: v2.58,22.61 2.58,5.33 3.72,5.33 3.98,5.08 v3.98,4.19
N$8  (via drill 0.33)
  Top 0.279: S1.P$1 13.5,10.16
  Top 0.406: 13.5,10.16 13.5,7.11 v11.21,8 | D6.C 1.69,3.3 4.23,1.4 8.42,1.4 9.44,2.16 9.44,7.11 | v8.29,8 9.44,7.11 | 9.44,7.11 D4.C
  Bottom 0.406: v11.21,8 v8.29,8
N$9
  Top 0.61: D10.P$2 22.52,49.91 21.76,51.23 11.83,51.23 Q10.P$3
N$10
  Top 0.406: L2.1 13.06,26.23 IC$2.5
N$11
  Top 0.406: 10.2,48.02 10.2,48.64 10.45,49.53
  Top 0.61: D11.P$2 25.44,52.07 10.96,52.07 10.58,49.91 10.45,49.53 | Q11.P$3 10.2,48.02
N$12  (via drill 0.33)
  Top 0.254: v5.58,46.18 5.5,45.44 6.9,45.34 C13.2
  Bottom 0.254: 6.01,48.77 6.52,48.13 6.52,46.1 v5.58,46.18
  Bottom 0.305: 6.01,48.77 IC$4.27
N$13
  Top 0.813: R6.2 R7.1
N$14
  Top 0.61: R9.2 23.53,39.37 24.42,38.48 25.42,38.48 Q3.P$3
  Top 0.813: C8.2 R9.2
N$15  (via drill 0.33)
  Top 0.305: C10.2 24.68,43.81 v24.55,44.58
  Bottom 0.305: 23.41,49.02 IC$4.2
  Bottom 0.406: v24.55,44.58 23.41,49.02
N$16  (via drill 0.33)
  Top 0.406: C10.1 23.1,42.42 23.1,44.45 v23.66,44.45
  Bottom 0.305: 22.77,48.9 IC$4.3
  Bottom 0.406: v23.66,44.45 22.77,48.9
N$17  (via drill 0.33)
  Top 0.406: Q13.P$3 v6.34,28.32 | v1.82,35.46 R19.1
  Bottom 0.406: v6.34,28.32 4.23,28.45 2.58,30.23 2.07,32 2.07,34.42 v1.82,35.46
N$18
  Top 0.813: R5.2 R6.1
N$19  (via drill 0.33)
  Top 0.406: R12.2 6.64,48.39 v6.9,49.15
  Bottom 0.305: 6.64,49.53 IC$4.26
  Bottom 0.406: v6.9,49.15 6.64,49.53
N$20
  Top 0.254: 25.81,42.05 Q1.P$2
  Top 0.406: 25.81,42.05 Q2.P$3 25.29,41.15
  Top 0.61: Q5.P$3 18.82,41.67 19.34,41.27 19.72,41.15 20.1,40.51 20.1,40.39 23.41,40.39 24.04,40.77 25.29,41.15
N$21
  Top 0.406: Q1.P$3 25.31,44.2 25.18,45.85
  Top 0.813: R7.2 26.07,46.98 26.07,45.72 25.76,45.78 25.18,45.85 24.68,45.77 C6.2
N$22
  Top 0.406: 25.81,36.33 26.45,35.43 26.71,34.16 26.45,32.64 23.53,32.79 20.74,32.77 20.23,32.99 20.1,33.91 Q6.P$2
  Top 0.61: Q3.P$2 25.94,36.46 25.81,36.33 Q4.P$3
N$23  (via drill 0.33)
  Top 0.203: 2.07,38.1 1.66,38.61 1.54,39.5 1.64,39.93 2.2,39.93 2.26,40.21 3.09,40.39
  Top 0.254: 2.07,38.1 2.32,37.34 0.98,36.83 0.96,36.2 0.93,34.8 v1.15,34.29 1.05,34.54 | 3.09,40.39 IC$1.2
  Bottom 0.305: v1.15,34.29 0.67,33.91 0.8,2.92 TSDBG.TP
N$24  (via drill 0.33)
  Top 0.406: C11.1 v18.58,44.73
  Bottom 0.305: 21.37,48.9 IC$4.5
  Bottom 0.406: v18.58,44.73 21.37,48.9
N$25
  Top 0.406: 4.98,31.35 R22.1 5.63,30.23 5.63,28.78 2.07,28.78 1.82,29.99 R24.1 1.69,30.1 1.56,30.48 1.56,31.22 IC$6.1
N$26  (via drill 0.33)
  Top 0.254: 7.91,46.63 7.87,46.45
  Top 0.353: 6.6,46.63 7.91,46.63
  Top 0.356: 4.61,45.57 4.86,45.72 4.89,45.85 4.89,47.85 6.6,47.85 6.6,46.63
  Top 0.381: 10.06,46.47 10.07,47.37 8.29,47.37
  Top 0.406: 11.98,46.61 10.69,46.35 10.57,46.47 | 10.57,46.47 Q11.P$2 | 10.06,46.47 10.57,46.47 | 7.66,46.08 Q9.P$2 7.87,46.45 8.29,47.37 | 4.61,45.57 Q8.P$2 | 11.98,46.61 12.74,46.48 13.12,46.23 v14.39,46.1 14.5,46.7 | 14.39,46.23 14.5,46.7 | 14.5,46.7 IC$3P.6 | 11.98,46.61 Q10.P$2
  Top 0.546: 19.34,38.73 19.09,39.37
  Top 0.61: Q5.P$2 18.95,39.87 19.09,39.37 18.71,38.71 17.31,38.71 17.11,39.5 17.11,42.04 v16.04,42.8 | 19.34,38.73 19.47,38.35 20.23,36.45 19.98,35.69 Q6.P$3
  Bottom 0.61: v16.04,42.8 16.04,44.2 15.66,44.58 14.39,45.09 v14.39,46.1
N$27  (via drill 0.33)
  Top 0.356: v19.6,44.45 C11.2
  Bottom 0.305: 22.14,48.77 IC$4.4
  Bottom 0.406: v19.6,44.45 22.14,48.77
N$28  (via drill 0.33)
  Top 0.406: R1.2 v21.5,23.37 | v20.74,17.53 21.25,17.4 U2.D+
  Bottom 0.406: v21.5,23.37 23.66,22.23 23.66,18.67 v20.74,17.53
N$29  (via drill 0.33)
  Top 0.406: R21.1 10.33,2.16 11.09,2.16 12.36,3.56 14.39,3.56 R20.2 v16.8,2.03 | U$3.P$3 v16.93,16.26
  Bottom 0.406: v16.93,16.26 17.18,14.86 17.31,3.56 v16.8,2.03
N$31
  Top 0.305: IC$3P.2 14.01,41.96
  Top 0.406: R14.2 9.31,43.05 10.83,43.56 11.72,44.35 13.63,44.35 13.75,43.69 IC$3P.2 | 14.01,41.96 15.53,41.96 R13.2
N$32
  Top 0.406: R2.2 20.61,14.35 20.61,16.51 21.25,16.64 U2.D-
N$33  (via drill 0.33)
  Top 0.305: C3.2 14.52,20.57 12.61,20.57 12.36,21.84 R3.2
  Top 0.406: R3.2 v11.85,23.85 | v13.88,24.51 IC$2.4
  Top 0.61: R4.2 18.45,23.5 18.07,24.38 C2.2 IC$2.4
  Bottom 0.406: v11.85,23.85 v13.88,24.51
OAOUT1  (via drill 0.33)
  Top 0.284: 15.71,48.15 13.88,48.15
  Top 0.29: 13.88,48.15 IC$3P.7 | 15.71,48.15 15.79,47.37
  Top 0.305: 15.79,47.37 15.79,46.86 R5.1
  Top 0.406: 17.18,46.09 17.18,45.72 17.06,45.59 | 15.84,45.34 15.41,44.96 14.52,44.32 IC$3P.3 | IC$3P.7 13.75,47.24
  Top 0.61: 17.06,45.59 15.84,45.34 | R9.1 v19.98,39.5 | v19.98,42.04 20.98,41.91
  Top 0.813: 17.18,45.72 18.83,45.72 C6.1 R8.1 20.98,41.91 C7.1 | 17.18,46.09 R5.1 | R9.1 C8.1 21.25,36.83 21.25,36.2 R10.1 C9.1
  Bottom 0.61: v19.98,39.5 v19.98,42.04
OAOUT2
  Top 0.254: 9.44,41.66 8.55,40.89 IC$1.15
  Top 0.363: 13.26,42.16 13.64,41.41 14.52,41.41
  Top 0.368: 13.26,42.16 IC$3P.1 | 14.52,41.41 R13.1
  Top 0.406: 12.87,42.67 IC$3P.1
  Top 0.61: 9.44,41.66 11.63,42.65 | 11.63,42.65 11.21,42.42 | 12.87,42.67 11.63,42.65
OAPWR  (via drill 0.33)
  Top 0.229: Q12.P$1 26.95,43
  Top 0.254: 26.95,43 26.95,41.78 26.73,40.64
  Top 0.305: 26.73,40.64 27.42,40.39 27.42,38.61 R15.1 v26.73,38.86
  Top 0.406: v14.52,37.59 13.37,37.72 13.37,39.73 IC$3.10
  Bottom 0.305: 24.8,35.94 v26.73,38.86
  Bottom 0.406: v14.52,37.59 15.15,37.16 19.34,37.16 24.8,35.94
PBI$1  (via drill 0.33)
  Top 0.279: v7.95,34.11 8.48,33.69 8.98,31.88 | IC$1.5 3.85,38.48
  Top 0.305: 8.48,33.69 8.52,33.66 | S2.P$1 10.96,30.46 8.67,30.35 8.62,30.38 8.6,30.61 8.73,31.24 8.98,31.88 | 3.85,38.48 v3.85,35.05
  Top 0.406: v3.72,8.38 3.72,7.17 D4.A | v7.07,30.28 8.62,30.38
  Bottom 0.203: 4.61,34.8 4.61,33.68 7.02,33.68 v7.95,34.11
  Bottom 0.305: v3.85,35.05 4.61,34.8
  Bottom 0.406: v3.72,8.38 4.36,9.65 4.48,26.8 7.07,26.8 v7.07,30.28
PBI$2  (via drill 0.33)
  Top 0.203: 2.83,36.07 2.9,39.37 3.09,39.37
  Top 0.254: 1.31,33.66 v1.33,33.15 | 2.83,36.07 2.83,34.8 | 3.09,39.37 IC$1.4
  Top 0.259: 1.78,34.8 1.78,33.66
  Top 0.279: 1.94,34.8 1.78,34.8 | 1.78,33.66 1.31,33.66
  Top 0.305: 1.94,34.8 2.83,34.8
  Top 0.406: v1.56,14.1 S3.P$1 D6.A 2.32,6.35 2.32,3.53 3.72,3.43 4.48,3.05 D7.A
  Bottom 0.406: v1.56,14.1 1.56,25.78 1.44,33.4 v1.33,33.15
PBI$3  (via drill 0.33)
  Top 0.279: IC$1.6 4.74,36.32
  Top 0.305: v19.34,25.91 S4.P$1 | v3.09,4.22 D5.A | v18.33,19.43 19.47,19.81 v20.23,22.99 | 4.74,36.32 4.53,35.94 4.53,34.16 v3.85,34.16
  Bottom 0.203: 14.14,34.04 12.87,34.09 9.94,34.16 9.82,34.21 8.6,34.21 8.6,33.53
  Bottom 0.305: 14.14,34.04 14.26,33.4 14.52,31.37 v19.34,25.91 19.98,24.38 v20.23,22.99 | v18.33,19.43 16.93,17.65 13.68,15.75 13.68,1.78 13.37,1.4 3.59,1.4 v3.09,4.22 | v3.85,34.16 3.85,33.27 7.79,33.27 8.6,33.53
SCRCLK  (via drill 0.33)
  Top 0.254: v12.23,43.64 11.21,43.18 8.93,42.16 v8.65,42.11 | v17.27,47.74 19.09,47.75 19.22,47.62 v19.44,47.78 19.22,48.39 19.22,49.02 18.33,49.25 16.68,49.25 16.42,49.91 14.01,49.91 v13.45,49.31 | IC$1.16 v7.4,42.11
  Bottom 0.254: v13.45,49.31 12.23,49.53 IC$4.18 | v17.27,47.74 17.31,48.26 15.66,48.26 15.66,47.5 16.55,44.7 16.68,44.2 16.68,41.66 15.28,42.16 13.37,43.05 12.81,43.29 | v12.23,43.64 12.81,43.29 | 12.81,43.29 12.99,43.18 | v7.4,42.11 v8.65,42.11
SCRCS  (via drill 0.33)
  Top 0.254: v8.04,38.24 IC$1.11
  Bottom 0.229: IC$4.13 16.04,49.53
  Bottom 0.254: 16.04,49.53 17.92,49.15
  Bottom 0.292: 8.8,38.3 9.69,38.3 10.2,38.35
  Bottom 0.305: 8.8,38.3 v8.04,38.24 | 17.92,49.15 17.95,46.1 17.82,44.2 17.72,41.27 16.29,38.35 16.04,38.1 14.52,38.66 10.58,38.41 10.2,38.35
SCRDAT  (via drill 0.33)
  Top 0.203: IC$1.19 5.25,43.66 4.86,43.81 v4.36,44.09
  Top 0.305: v10.43,45.41 11.34,45.72 v12.48,45.59
  Bottom 0.203: 11.6,49.55 8.04,49.55 7.66,49.02
  Bottom 0.241: 7.66,48.34 11.47,48.34
  Bottom 0.254: 12.36,48.34 11.47,48.34 | IC$4.19 11.6,49.55 | 7.66,49.02 7.66,48.34
  Bottom 0.305: v10.43,45.41 9.44,46.73 7.66,46.73 7.79,45.01 4.86,45.01 4.74,44.88 v4.36,44.09 | v12.48,45.59 12.36,48.34
SCRDC  (via drill 0.33)
  Top 0.254: IC$1.20 4.76,43.43 2.71,43.43 | 1.18,46.86 3.09,46.86
  Top 0.305: v9.49,48.96 9.56,50.55 9.18,51.94 3.47,51.94 2.71,51.69 2.45,51.31 2.2,50.42 2.2,49.66 3.09,49.66 3.09,46.86 | 1.18,46.86 1.18,44.7 1.56,44.45 2.45,44.45 2.71,43.43
  Bottom 0.305: 14.39,50.83 IC$4.15 14.1,48.77 13.78,48.49 12.1,48.87 10.2,49.02 v9.49,48.96
SCRPWR  (via drill 0.33)
  Top 0.178: 18.07,33.4 19.09,33.4 19.09,34.42 18.83,34.67 18.45,35.08
  Top 0.254: R11.1 17.56,37.34 17.56,35.2 18.45,35.08 | 18.07,33.4 17.31,33.4 17.01,33.53 17.01,34.42 15.41,34.42 14.52,35.81 13.37,35.77 13.35,34.92 12.48,34.92 IC$3.3
  Top 0.305: IC$3.3 12.1,33.4 v11.34,32.72 | v1.69,41.48 1.44,41.85 Q7.P$1 | Q13.P$1 v9.54,29.27
  Top 0.406: R25.2 v9.54,29.27
  Bottom 0.254: 13.12,33.17 11.85,33.17 | 3.16,32.89 3.85,32.82 7.28,32.77 10.58,33.06 | 1.31,38.1 1.03,39.5
  Bottom 0.279: 13.25,30.1 13.25,33.15 | 1.03,39.5 1.04,41.53 | 11.85,33.17 v11.34,32.72
  Bottom 0.305: v11.34,32.72 10.58,33.06 | v9.54,29.27 13.25,30.1 | 13.25,33.15 13.12,33.17 | 1.04,41.53 v1.69,41.48 | 3.16,32.89 3.16,35.94 1.44,37.85 1.31,38.1
SCRRES  (via drill 0.33)
  Top 0.254: IC$1.1 3.63,40.93
  Top 0.279: 3.63,40.93 v3.65,41.78
  Bottom 0.229: 14.97,50.82 14.72,49.15
  Bottom 0.254: 12.1,44.83 11.72,45.21 11.72,47.92 10.45,47.88 10.2,47.62 10.2,47.24 7.02,47.24 7.15,46.48 | 14.72,49.15 14.44,48.26
  Bottom 0.305: v3.65,41.78 3.34,42.55 3.32,43.43 3.82,44.88 4.48,45.52 7.15,45.54 7.15,46.48 | 12.1,44.83 13.25,44.96 13.25,47.5 14.44,48.26 | 14.97,50.82 IC$4.14
SCRVREG  (via drill 0.33)
  Top 0.406: Q7.P$3 1.04,43.71 0.67,44.2 0.67,47.24 1.44,47.5 1.42,47.51 C12.2 v2.32,48.9
  Bottom 0.305: 18.58,50.84 IC$4.9 | 5.25,52.07 5.5,52.27 18.07,52.27 18.45,52.2 20.61,52.2 IC$4.6
  Bottom 0.406: v2.32,48.9 3.98,48.9 5.25,49.4 IC$4.28 5.25,52.07 | 18.45,52.2 IC$4.9
SRA  (via drill 0.33)
  Top 0.203: 2.6,39.85 2.96,39.88
  Top 0.229: 2.96,39.88 IC$1.3
  Top 0.254: IC$3.1 11.47,34.16 11.85,35.05 v12.66,35.56 | 2.48,39.24 2.6,39.85
  Top 0.305: IC$3.2 IC$3.1 | v2.24,39.32 2.48,39.24
  Bottom 0.203: v12.66,35.56 11.54,35.92 10.53,35.87 10.33,35.69 8.67,35.64 7.28,35.81 6.01,35.99
  Bottom 0.254: v2.24,39.32 2.83,37.97 4.1,36.7 6.01,35.99
SRCLK  (via drill 0.33)
  Top 0.254: 8.93,39.88 IC$1.13
  Top 0.305: 8.93,39.88 9.44,39.37 v9.4,39.07 | v15.41,39.24 IC$3.8
  Bottom 0.305: v9.4,39.07 14.26,39.12 v15.41,39.24
STG$1  (via drill 0.33)
  Top 0.254: 26,40.86 26.51,41.91
  Top 0.279: 26.51,41.91 26.51,42.88 25.18,42.93
  Top 0.305: Q4.P$1 24.94,34.79 24.17,35.56 24.17,36.43 Q3.P$1 | Q3.P$1 24.94,37.33 | 25.18,42.93 25.06,42.8 25.06,42.4 Q1.P$1 | Q3.P$1 24.93,37.72 25.06,37.85 26.07,37.85 26.07,38.86 25.95,39.12 25.18,39.12 24.94,39.36 Q2.P$1 24.94,40.14 25.18,40.39 26,40.39 26,40.86
  Top 0.406: IC$3.5 13.39,32.62 v15.91,32 | v23.66,34.54 24.93,34.67 Q4.P$1
  Bottom 0.406: v23.66,34.54 21.76,32.26 19.47,31.62 18.2,31.62 18.07,31.5 17.06,30.61 16.68,31.11 v15.91,32
STG$2  (via drill 0.33)
  Top 0.305: Q6.P$1 18.14,34.61 | IC$3.6 14.01,33.27 14.26,33.02 16.17,32.77 16.8,32.38 v17.18,32.13 | v17.69,34.04 18.14,34.61 | v16.98,37.9 17.06,37.34 17.06,35.71 17.06,35.1 17.18,34.82 17.56,34.72 18.14,34.61
  Top 0.406: v18.07,39.57 Q5.P$1 | 18.07,40.51 Q5.P$1 | Q5.P$1
  Bottom 0.305: v17.18,32.13 19.22,32.13 20.61,32.51 20.36,33.66 19.09,33.66 v17.69,34.04
  Bottom 0.406: v16.98,37.9 17.31,38.48 v18.07,39.57
VBAT
  Top 0.406: 3.2,16.27 J2.2
  Top 0.61: 3.2,16.27 3.59,16.64 5.88,16.64 | 5.88,16.64 6.26,16.64 Q15.P$3 | IC$5.3 21.88,27.45 18.83,27.45 18.07,28.07 16.42,28.07 C15.1 15.53,27.94 10.6,27.94 10.6,25.65 9.06,25.65 | 5.88,16.64 5.88,18.8 5.37,19.68 5.37,22.1 8.29,22.1 8.93,24 9.06,25.65 | R18.2 5.12,27.18 8.42,26.92 8.67,26.29 9.06,25.65
VCC
  Top 0.356: C1.2 12.38,26.16 12.38,24.5 12.99,24.49
  Top 0.368: IC$2.1 12.99,24.26 12.99,24.49
  Top 0.406: IC$2.1 13.06,21.91 13.37,21.08 14.9,21.08 15.11,21.84 IC$2.3 | Q14.P$2 10.59,14.72 Q15.P$2
  Top 0.61: Q15.P$2 14.12,15.99 16.8,18.67 16.8,19.81 15.28,21.34 15.23,21.72 15.11,21.84
VREF  (via drill 0.33)
  Top 0.279: 5.25,37.62 IC$1.7 5.25,36.83
  Top 0.305: 5.25,35.94 5.25,36.83
  Top 0.406: 5.25,35.94 5.04,35.31 5.04,33.97 R22.2 IC$6.2 v4.36,30.33 | R23.2 v6.44,31.65
  Bottom 0.406: v6.44,31.65 4.99,30.86 v4.36,30.33
VREG  (via drill 0.33)
  Top 0.279: 6.26,37.21 IC$1.9
  Top 0.292: 13.25,48.59 16.04,48.59
  Top 0.305: 6.59,36.7 6.26,37.21 | Q7.P$2 2.71,41.15 2.32,40.77 v1.68,40.64 | IC$3P.8 13.25,48.59 | v6.59,34.29 7.15,35.05 7.63,35.03 | v16.43,47.62 16.29,48.13 16.29,48.39 16.04,48.59
  Top 0.356: 13.29,40.89 12.91,41.55 | 7.66,34.92 7.28,34.67 7.28,33.78 R23.1
  Top 0.381: C16.1 6.59,36.7 | 11.09,38.35 IC$3.14 10.77,40.39
  Top 0.394: 10.83,41.55 12.91,41.55
  Top 0.406: 14.14,38.38 14.77,38.35 15.53,38.1 15.53,35.81 16.28,35.07 C5.2 16.42,35.56 v16.29,36.45 | 14.14,38.38 14.01,39.72 IC$3.9 14.01,40.64 13.88,40.74 13.29,40.89 | IC$3P.8 12.61,47.88 12.61,50.42 16.55,50.42 C14.1 | R11.2 v18.2,35.81 | 10.83,41.55 10.77,41.4 10.77,40.39 | v16.24,40.01 16.29,39.5 16.29,38.61 15.28,38.35 14.14,38.38 | 11.09,38.35 11.24,37.08 11.21,36.7 v11.11,35.28 | 7.66,34.92 7.63,35.03 C16.1 | v14.01,25.78 L2.2 | v10.53,24.19 10.58,23.75 R3.1 | R23.1 8.17,32.77 8.42,31.88 v7.87,31.11
  Top 0.61: J1.2 19.72,0.89 13.63,0.89 R21.2 v12.81,2.54 | C4.2 C3.1 | C3.1 11.85,20.07 11.72,21.21 R3.1 | v14.77,18.41 13.5,18.67 C3.1
  Bottom 0.279: 1.55,39.5 1.61,38.81
  Bottom 0.305: v1.68,40.64 1.55,39.5 | 5.07,35.65 5.88,35.56 8.67,35.2 v11.11,35.28 10.83,35.18 | 5.07,35.65 3.98,35.94 2.45,37.59 2.2,37.85 1.61,38.81 | v6.59,34.29 6.13,34.16 5.07,34.16 5.07,35.65
  Bottom 0.406: v18.2,35.81 17.44,36.2 v16.29,36.45 | v16.43,47.62 16.8,46.35 17.18,44.58 17.18,41.4 16.42,40.13 v16.24,40.01 | v10.53,24.19 12.74,25.15 v14.01,25.78 11.85,27.43 11.72,28.45 8.7,28.45 8.7,29.97 10.96,30.43 9.94,32 8.67,31.88 v7.87,31.11
  Bottom 0.61: v14.77,18.41 13.07,16.26 13.07,3.05 v12.81,2.54
VUSB
  Top 0.406: 21.88,15.62 U2.VBUS 23.15,16.13 23.53,16.51 23.53,20.83 24.19,23.62 | IC$5.4 21.76,32.08
  Top 0.61: 18.58,12.06 21.88,12.06 21.63,14.35 21.88,15.62 | 18.58,12.06 13.63,12.06 13.1,13.32 Q14.P$3 | 24.19,23.62 24.19,27.69 R17.2 24.68,29.72 24.68,30.86 24.55,32 22.9,32.08 21.76,32.08 | C17.2 18.58,12.06